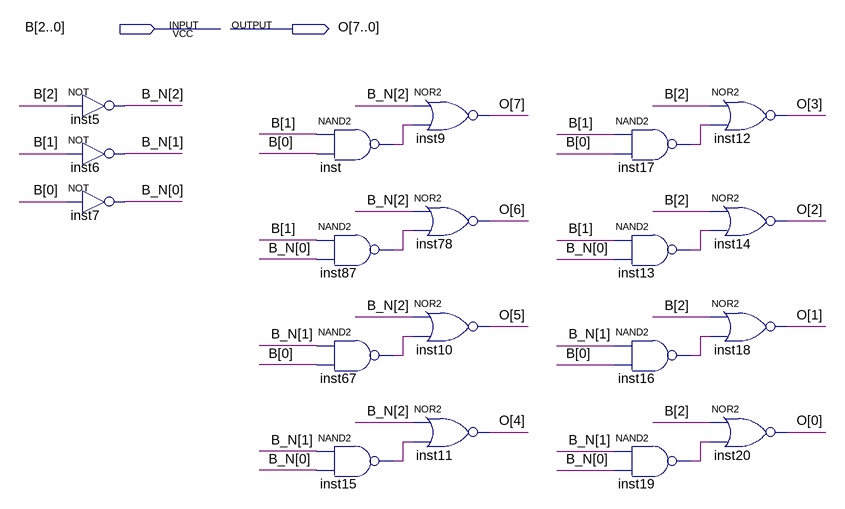
[diagram p0: schematic sheet]
// Quartus schematic DECODER_3BIT.bdf as structural Verilog: 19 symbols, 2 pins
module DECODER_3BIT (
  input  [2:0] B,
  output [7:0] O
);

  wire inst13_out, inst15_out, inst16_out, inst17_out, inst19_out, inst67_out, inst87_out, inst_out;
  wire [2:0] B_N;

  not inst5 (B_N[2], B[2]);
  not inst6 (B_N[1], B[1]);
  not inst7 (B_N[0], B[0]);
  nand inst (inst_out, B[1], B[0]);
  nand inst87 (inst87_out, B[1], B_N[0]);
  nand inst67 (inst67_out, B_N[1], B[0]);
  nand inst15 (inst15_out, B_N[1], B_N[0]);
  nor inst9 (O[7], B_N[2], inst_out);
  nor inst78 (O[6], B_N[2], inst87_out);
  nor inst10 (O[5], B_N[2], inst67_out);
  nor inst11 (O[4], B_N[2], inst15_out);
  nand inst17 (inst17_out, B[1], B[0]);
  nand inst13 (inst13_out, B[1], B_N[0]);
  nand inst16 (inst16_out, B_N[1], B[0]);
  nand inst19 (inst19_out, B_N[1], B_N[0]);
  nor inst12 (O[3], B[2], inst17_out);
  nor inst14 (O[2], B[2], inst13_out);
  nor inst18 (O[1], B[2], inst16_out);
  nor inst20 (O[0], B[2], inst19_out);
endmodule
